# Altium schematic sheet 02_BLOCK-DIAGRAM.SchDoc
size 420 x 297 mm; Web: www.byte-lab.com; PageNumber: 02
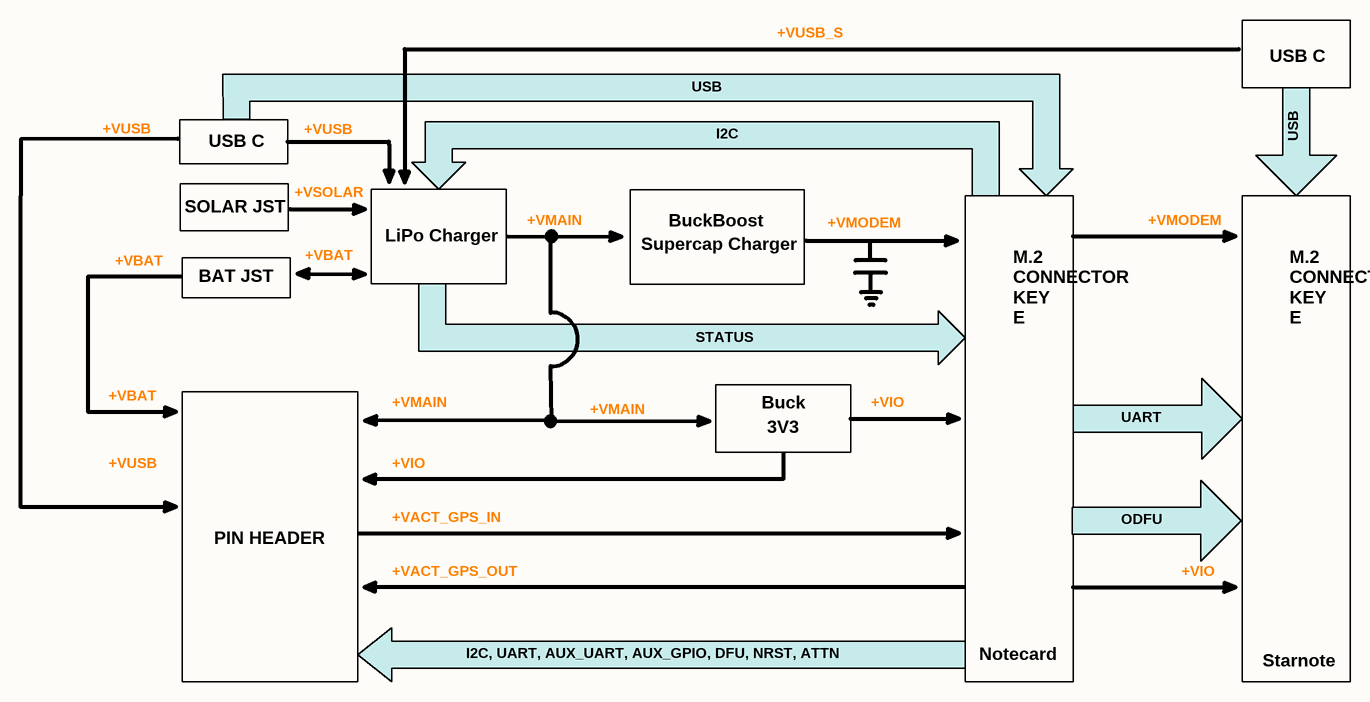
[diagram p0: 02_BLOCK-DIAGRAM.SchDoc]

## Parts
?  (no value)  (graphical)

## Notes on the sheet
- USB
- +VUSB_S
- USB C
- +VUSB
- I2C
- SOLAR JST
- +VSOLAR
- +VMAIN
- BuckBoost
- +VMODEM
- +VBAT
- BAT JST
- LiPo Charger
- Supercap Charger
- STATUS
- Buck
- 3V3
- +VIO
- UART
- +VACT_GPS_IN
- ODFU
- PIN HEADER
- +VACT_GPS_OUT
- M.2 CONNECTOR KEY E
- I2C, UART, AUX_UART, AUX_GPIO, DFU, NRST, ATTN
- Notecard
- Starnote
- Board
- Project
- Page name
- Project Code
- Designer
- Internal Code
- Approved
- Customer
- Code
- Il presente progetto è tutelato dalla legge sul diritto d'autore, che vieta a terzi la riproduzione e l'utilizzo anche parziale senza il consenso di FAE Technology S.p.A.
- Data
- Rev.
- Rev. changes
- Sheet
- /

## Library data of the parts
? = MyFAETechnology